# Altium schematic sheet Accelerometer.SchDoc: Accelerometer
size A4; SheetNumber: 6; SheetTotal: 10; Project: WSN Z1; Comments: Accelerometer
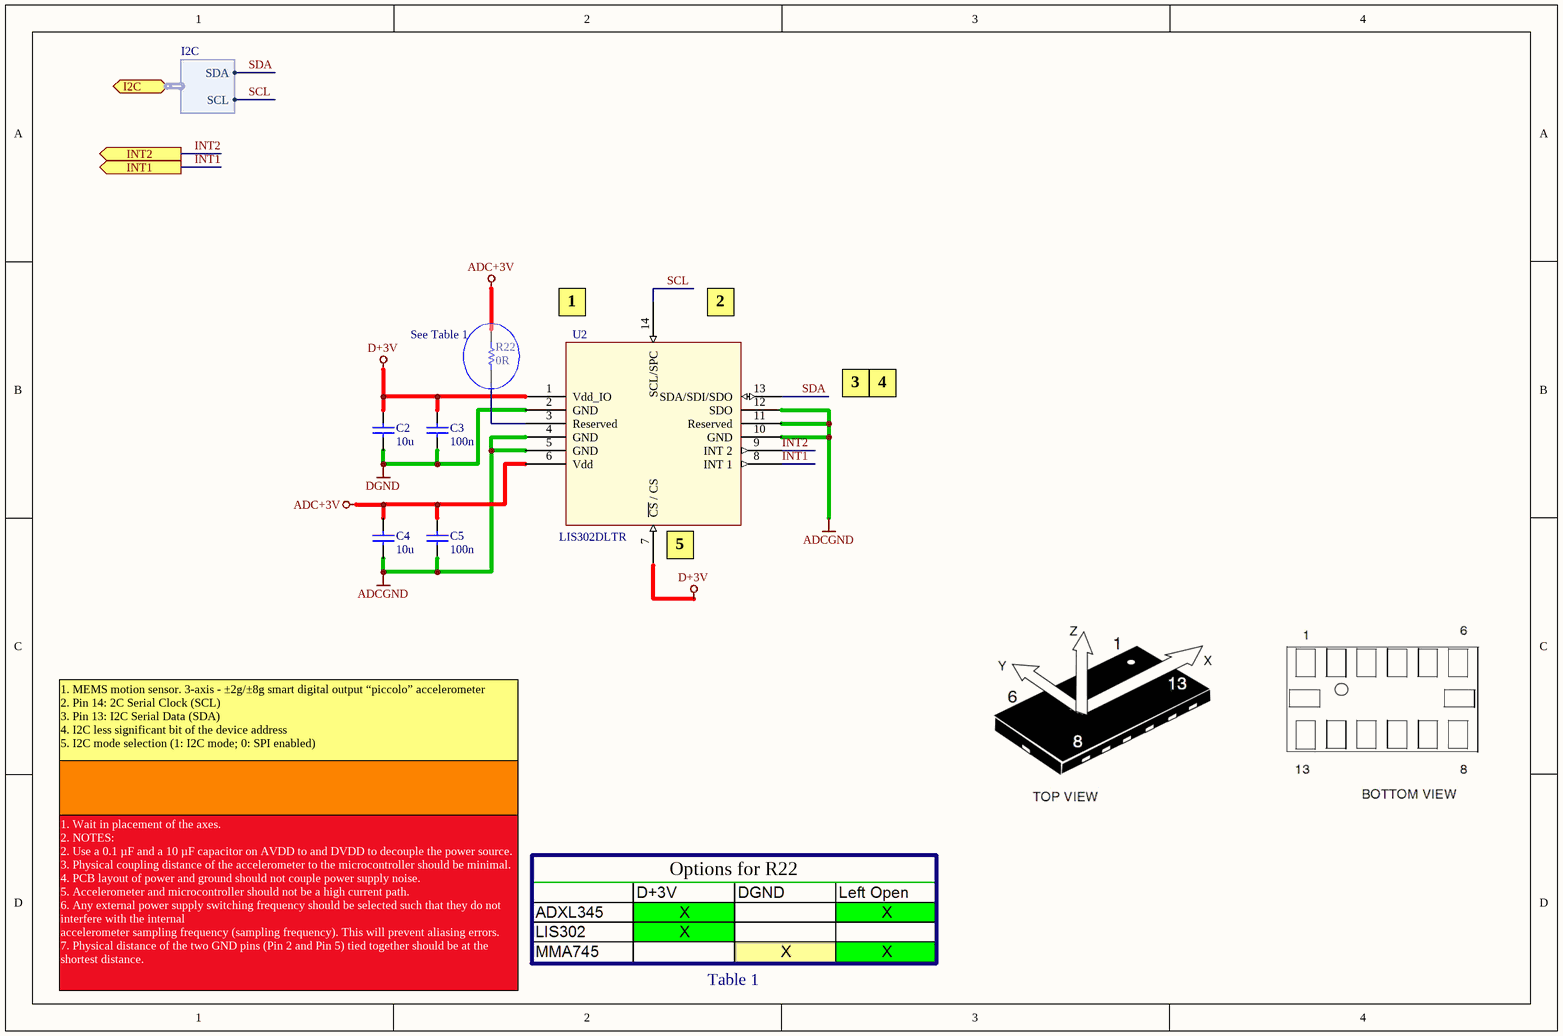
[diagram p0: Accelerometer.SchDoc]

## Parts
C2  value 10u  [CC1608-0603]  (hidden comment: Cap Semi)
C3  value 100n  [CC-0402-AL]  (hidden comment: Cap Semi)
C4  value 10u  [CC1608-0603]  (hidden comment: Cap Semi)
C5  value 100n  [CC-0402-AL]  (hidden comment: Cap Semi)
R22  value 0R  [CR-0402-AL]  (hidden comment: Res Semi)
U2  LIS302DLTR  [LGA-3x5x1 0.8 - 1.5]

## Ports
I2C (harness I2C), INT1 (out), INT2 (out)

## Harnesses
I2C: SCL, SDA

## Nets
ADC+3V: C4.2 C5.2 R22.2 U2.6(Vdd)
ADCGND: C4.1 C5.1 U2.4(GND) U2.5(GND) U2.10(GND) U2.11(Reserved) U2.12(SDO)
D+3V: C2.2 C3.2 U2.1(Vdd_IO) U2.7(~{CS}_/_CS)
DGND: C2.1 C3.1 U2.2(GND)
INT1: U2.8(INT_1) ; port INT1
INT2: U2.9(INT_2) ; port INT2
SCL: U2.14(SCL/SPC) ; port I2C.SCL
SDA: U2.13(SDA/SDI/SDO) ; port I2C.SDA
NetR22_1: R22.1 U2.3(Reserved)

## Notes on the sheet
- (near U2) 1
- (near U2) 2
- (near R22) See Table 1
- 3
- 4
- (near U2) 5
- 1. MEMS motion sensor. 3-axis - ±2g/±8g smart digital output “piccolo” accelerometer
  2. Pin 14: 2C Serial Clock (SCL)
  3. Pin 13: I2C Serial Data (SDA)
  4. I2C less significant bit of the device address
  5. I2C mode selection (1: I2C mode; 0: SPI enabled)
- Options for R22
- 1. Wait in placement of the axes.
  2. NOTES:
  2. Use a 0.1 µF and a 10 µF capacitor on AVDD to and DVDD to decouple the power source.
  3. Physical coupling distance of the accelerometer to the microcontroller should be minimal.
  4. PCB layout of power and ground should not couple power supply noise.
  5. Accelerometer and microcontroller should not be a high current path.
  6. Any external power supply switching frequency should be selected such that they do not interfere with the internal
  accelerometer sampling frequency (sampling frequency). This will prevent aliasing errors.
  7. Physical distance of the two GND pins (Pin 2 and Pin 5) tied together should be at the shortest distance.
- Table 1

## Library data of the parts
C2 C4 = Cap Semi: CAP CER 10UF 6.3V X5R 0603
C3 C5 = Cap Semi: Capacitor (Semiconductor SIM Model)
R22 = Res Semi: Semiconductor Resistor; Manufacturer: Generic Components
U2 = LIS302DL: MEMS motion sensor  3-axis - ±2g/±8g smart digital output “piccolo” accelerometer